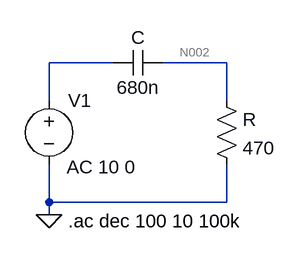
[diagram p0: schematic 3_Simulation.asc]
3_Simulation.asc, the LTspice schematic file:
Version 4
SHEET 1 880 680
WIRE 128 96 48 96
WIRE 272 96 192 96
WIRE 48 144 48 96
WIRE 272 144 272 96
WIRE 48 272 48 224
WIRE 272 272 272 224
WIRE 272 272 48 272
WIRE 48 288 48 272
FLAG 48 288 0
SYMBOL cap 128 112 R270
WINDOW 0 32 32 VTop 2
WINDOW 3 0 32 VBottom 2
SYMATTR InstName C
SYMATTR Value 680n
SYMBOL res 256 128 R0
SYMATTR InstName R
SYMATTR Value 470
SYMBOL voltage 48 128 R0
WINDOW 123 22 100 Left 2
WINDOW 39 0 0 Left 2
SYMATTR Value2 AC 10 0
SYMATTR InstName V1
SYMATTR Value ""
TEXT 72 296 Left 2 !.ac dec 100 10 100k

The netlist it stands for:
* 3_Simulation.asc
C N001 N002 680n
R N002 0 470
V1 N001 0 AC 10 0
.ac dec 100 10 100k
.backanno
.end

* Results of the author's LTspice run, read from the files saved beside the schematic
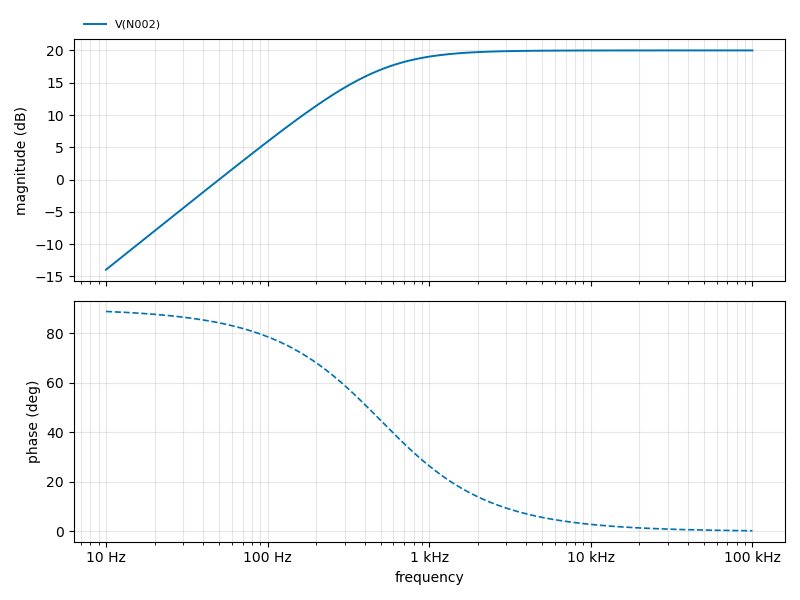
[diagram p1: AC Analysis of 3_Simulation.asc, plotted from the saved traces]
* AC Analysis, 1 run:
*   V(N002): -13.95 dB at 10 Hz, 20.00 dB at 100 kHz, peak 20.00 dB at 100 kHz, 3 dB below the peak at 498 Hz